# Altium schematic sheet ct_psu.SchDoc: Power Supply
size Letter; Organization: NewAE Technology Inc.; Address1: 1083 Queen St., Suite 196; Address2: Halifax; Address3: NS; Address4: Canada B3H 0B2; SheetNumber: 4; SheetTotal: 8; SheetApproved: YES
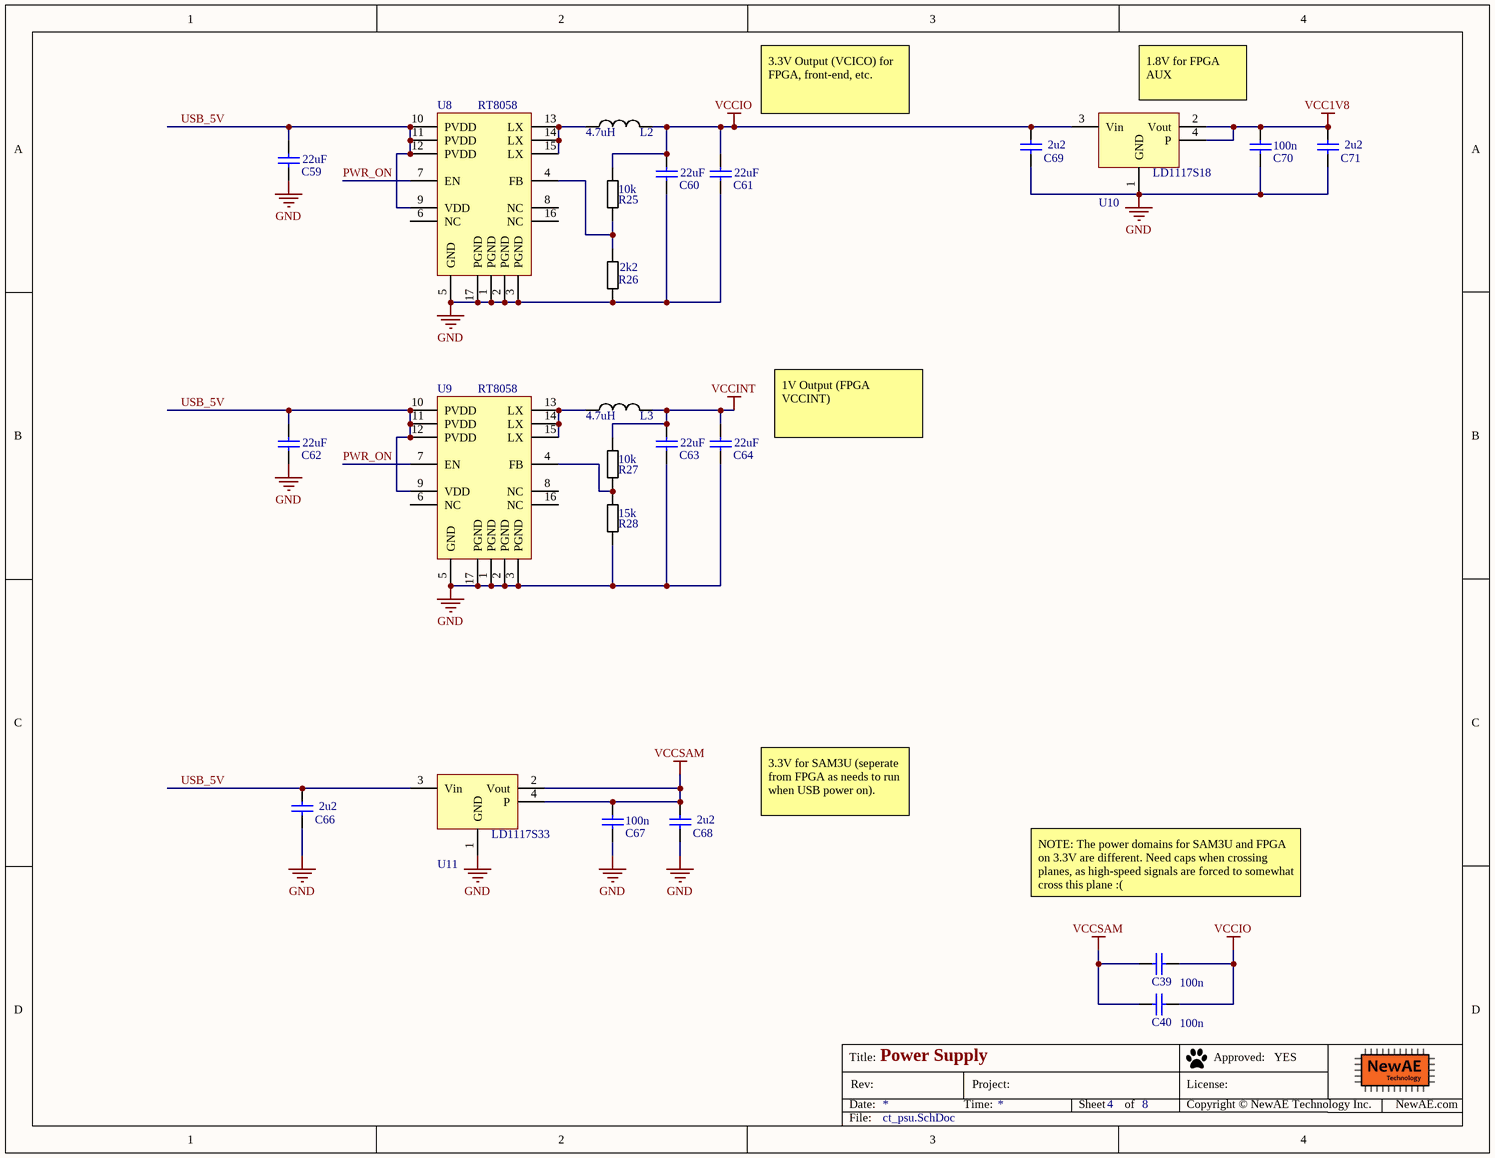
[diagram p0: ct_psu.SchDoc]

## Parts
C39  100n  [CAPC0603_M]
C40  100n  [CAPC0603_M]
C59  22uF  [CAPC0805_M]
C60  22uF  [CAPC0805_M]
C61  22uF  [CAPC0805_M]
C62  22uF  [CAPC0805_M]
C63  22uF  [CAPC0805_M]
C64  22uF  [CAPC0805_M]
C66  2u2  [CAPC0603_M]
C67  100n  [CAPC0402_M]
C68  2u2  [CAPC0603_M]
C69  2u2  [CAPC0603_M]
C70  100n  [CAPC0402_M]
C71  2u2  [CAPC0603_M]
L2  4.7uH  [NR6028]
L3  4.7uH  [NR6028]
R25  10k  [RESC1608X55N]
R26  2k2  [RESC1608X55N]
R27  10k  [RESC1608X55N]
R28  15k  [RESC1608X55N]
U8  RT8058  [QFN16_50P300X300X100_HS-17M]
U9  RT8058  [QFN16_50P300X300X100_HS-17M]
U10  LD1117S18  [SOT-223]
U11  LD1117S33  [SOT-223]

## Nets
GND: C59.2 C60.2 C61.2 C62.2 C63.2 C64.2 C66.2 C67.2 C68.2 C69.2 C70.2 C71.2 R26.2 R28.2 U8.1(PGND) U8.2(PGND) U8.3(PGND) U8.5(GND) U8.17(PGND) U9.1(PGND) U9.2(PGND) U9.3(PGND) U9.5(GND) U9.17(PGND) U10.1(GND) U11.1(GND)
VCC1V8: C70.1 C71.1 U10.2(Vout) U10.4(P)
VCCINT: C63.1 C64.1 L3.2 R27.1
VCCIO: C39.2 C40.2 C60.1 C61.1 C69.1 L2.2 R25.1 U10.3(Vin)
VCCSAM: C39.1 C40.1 C67.1 C68.1 U11.2(Vout) U11.4(P)
PWR_ON: U8.7(EN) U9.7(EN)
USB_5V: C59.1 C62.1 C66.1 U8.9(VDD) U8.10(PVDD) U8.11(PVDD) U8.12(PVDD) U9.9(VDD) U9.10(PVDD) U9.11(PVDD) U9.12(PVDD) U11.3(Vin)
NetL2_1: L2.1 U8.13(LX) U8.14(LX) U8.15(LX)
NetL3_1: L3.1 U9.13(LX) U9.14(LX) U9.15(LX)
NetR25_2: R25.2 R26.1 U8.4(FB)
NetR27_2: R27.2 R28.1 U9.4(FB)

Not connected (* = marked no-connect by the designer): U8 6(NC) 8(NC) 16(NC); U9 6(NC) 8(NC) 16(NC)

## Notes on the sheet
- 1.8V for FPGA AUX
- 3.3V Output (VCICO) for FPGA, front-end, etc.
- 1V Output (FPGA VCCINT)
- 3.3V for SAM3U (seperate from FPGA as needs to run when USB power on).
- NOTE: The power domains for SAM3U and FPGA on 3.3V are different. Need caps when crossing planes, as high-speed signals are forced to somewhat cross this plane :(
- Title:
- Date:
- Rev:
- Time:
- Project:
- Sheet
- of
- License:
- Copyright © NewAE Technology Inc.
- Approved:
- NewAE.com
- File:

## Library data of the parts
C39 C40 = CCHIP-100n-0603: 100n, 0603; Manufacture 1: Kemet; Manufacture Part Number 1: C0603C104K5RACTU; Component Group: Capacitor; Case-EIA: 0603; Case-Metric: 1608; Rated Voltage: 50VDC; Part Number: CCHIP-100n-0603; Footprint: 0603; Pin Count: 2; Supplier 1: Digi-Key; Supplier Part Number 1: 399-5089-2-ND; Value: 100n; Mounting Technology: SMT; Component Kind: Standard; Component Type: Standard
C59-C64 = CCHIP-22u-0805-16V: 22u, 16V, 0805, Ceramic; Manufacture 1: Samsung Electro-Mechanics; Manufacture Part Number 1: CL21A226MOCLRNC; Component Group: Capacitor; Case-EIA: 0805; Case-Metric: 1608; Rated Voltage: 16VDC; Tolerance: 20%; Part Number: CCHIP-22u-0805-16V; Footprint: 0805; Pin Count: 2; Supplier 1: Digi-Key; Supplier Part Number 1: 1276-6780-1-ND; Value: 22uF; Mounting Technology: SMT; RoHS: Yes; Component Kind: Standard; Component Type: Standard
C66 C68 C69 C71 = CCHIP-2u2-0603: 2u2, 0603; Manufacture 1: Samsung; Manufacture Part Number 1: CL10B225KP8NNNC; Component Group: Capacitor; Case-EIA: 0603; Case-Metric: 1608; Rated Voltage: 10VDC; Part Number: CCHIP-2u2-0603; Footprint: 0603; Pin Count: 2; Supplier 1: Digi-Key; Supplier Part Number 1: 1276-1134-2-ND; Value: 2u2; Mounting Technology: SMT; Component Kind: Standard; Component Type: Standard
C67 C70 = CCHIP-100n-0402: 100n, 0402; Component Group: Capacitor; Case-EIA: 0402; Part Number: CCHIP-100n-0402; Footprint: 0402; Pin Count: 2; Value: 100n; Mounting Technology: SMT; Component Kind: Standard; Component Type: Standard
L2 L3 = NR6028T4R7M: fixed ind, ferrite, shielded; Manufacture 1: Taiyo Yuden; Component Group: Inductor; Case-Metric: 6060; Part Number: NR6028T4R7M; Footprint: SMD,6x6mm; Manufacture Part Number 1: NR6028T4R7M; Pin Count: 2; Supplier 1: Digi-Key; Supplier Part Number 1: 587-2100-1-ND; Value: 4.7uH; Mounting Technology: SMT; Component Kind: Standard; Component Type: Standard
R25 R27 = RCHIP-10K-0603: 10k res, 0603, 1%, 1/10W; Manufacture 1: Yageo; Manufacture Part Number 1: RC0603FR-0710KL; Component Group: Resistor; Case-EIA: 0603; Case-Metric: 1608; Rated Power: 0.1W; Rated Voltage: 75VDC; Part Number: RCHIP-10K-0603; Footprint: 0603; Pin Count: 2; Supplier 1: Digi-Key; Supplier Part Number 1: 311-10.0KHRCT-ND; Value: 10k; Tolerance: 1%; Mounting Technology: SMT; Temperature Range: -55C to 155C; Component Kind: Standard; Component Type: Standard
R26 = RCHIP-2K2-0603: 2k2 res, 0603, 1%, 1/10W; Manufacture 1: Yageo; Manufacture Part Number 1: RC0603FR-072K2L; Component Group: Resistor; Case-EIA: 0603; Case-Metric: 1608; Rated Power: 0.1W; Rated Voltage: 75VDC; Part Number: RCHIP-2K2-0603; Footprint: 0603; Pin Count: 2; Supplier 1: Digi-Key; Supplier Part Number 1: 311-2.20KHRCT-ND; Value: 2k2; Tolerance: 1%; Mounting Technology: SMT; Temperature Range: -55C to 155C; Component Kind: Standard; Component Type: Standard
R28 = RCHIP-15K-0603: 15k res, 0603, 1%, 1/10W; Manufacture 1: Yageo; Manufacture Part Number 1: RC0603FR-0715KL; Component Group: Resistor; Case-EIA: 0603; Case-Metric: 1608; Rated Power: 0.1W; Rated Voltage: 75VDC; Part Number: RCHIP-15K-0603; Footprint: 0603; Pin Count: 2; Supplier 1: Digi-Key; Supplier Part Number 1: 311-15.0KHRCT-ND; Value: 15k; Tolerance: 1%; Mounting Technology: SMT; Temperature Range: -55C to 155C; Component Kind: Standard; Component Type: Standard
U8 U9 = RT8058: Switching supply controller, 2A; Manufacture 1: Richtek; Component Group: Analog IC; PP Material Stack: 0; Part Number: RT8058; Footprint: QFN16; Manufacture Part Number 1: RT8058; Pin Count: 17; Component Kind: Standard; Component Type: Standard; PP Rotation: 0
U10 = LD1117S18: IC REG LIN POS 1.8V 800MA SOT223; Manufacture 1: STMicroelectronics; Manufacture Part Number 1: LD1117S18TR; Component Group: Analog IC; Rated Voltage: 15V; PP Material Stack: 0; Part Number: LD1117S18; Pin Count: 3; Supplier 1: Digi-Key; Supplier Part Number 1: 497-7308-1-ND; Mounting Technology: SMT; RoHS: Yes; Component Kind: Standard; Component Type: Standard; PP Rotation: 0
U11 = LD1117S33: IC REG LIN POS 3.3V 800MA SOT223; Manufacture 1: STMicroelectronics; Manufacture Part Number 1: LD1117S33TR; Component Group: Analog IC; Rated Voltage: 15V; PP Material Stack: 0; Part Number: LD1117S33; Pin Count: 3; Supplier 1: Digi-Key; Supplier Part Number 1: 497-1242-1-ND; Mounting Technology: SMT; RoHS: Yes; Component Kind: Standard; Component Type: Standard; PP Rotation: 0